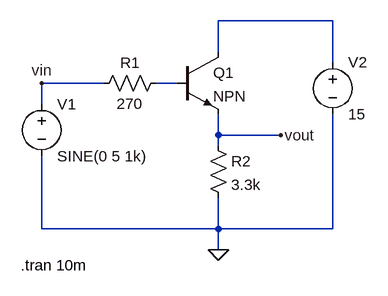
[diagram p0: schematic voltage_follower.asc]
voltage_follower.asc, the LTspice schematic file:
Version 4
SHEET 1 880 680
WIRE 432 32 256 32
WIRE 256 80 256 32
WIRE 432 96 432 32
WIRE 80 128 -16 128
WIRE 192 128 160 128
WIRE -16 160 -16 128
WIRE 256 208 256 176
WIRE 352 208 256 208
WIRE 256 224 256 208
WIRE -16 352 -16 240
WIRE 256 352 256 304
WIRE 256 352 -16 352
WIRE 432 352 432 176
WIRE 432 352 256 352
WIRE 256 384 256 352
FLAG 256 384 0
FLAG 352 208 vout
FLAG -16 128 vin
SYMBOL npn 192 80 R0
SYMATTR InstName Q1
SYMBOL res 176 112 R90
WINDOW 0 0 56 VBottom 2
WINDOW 3 32 56 VTop 2
SYMATTR InstName R1
SYMATTR Value 270
SYMBOL voltage -16 144 R0
WINDOW 123 0 0 Left 0
WINDOW 39 0 0 Left 0
SYMATTR InstName V1
SYMATTR Value SINE(0 5 1k)
SYMBOL voltage 432 80 R0
WINDOW 123 0 0 Left 0
WINDOW 39 0 0 Left 0
SYMATTR InstName V2
SYMATTR Value 15
SYMBOL res 240 208 R0
SYMATTR InstName R2
SYMATTR Value 3.3k
TEXT -48 408 Left 2 !.tran 10m

The netlist it stands for:
* voltage_follower.asc
Q1 N001 N002 vout 0 NPN
R1 N002 vin 270
V1 vin 0 SINE(0 5 1k)
V2 N001 0 15
R2 vout 0 3.3k
.model NPN NPN
.model PNP PNP
.lib standard.bjt
.tran 10m
.backanno
.end